# Altium schematic sheet Mother Board Connectors.SchDoc
size B
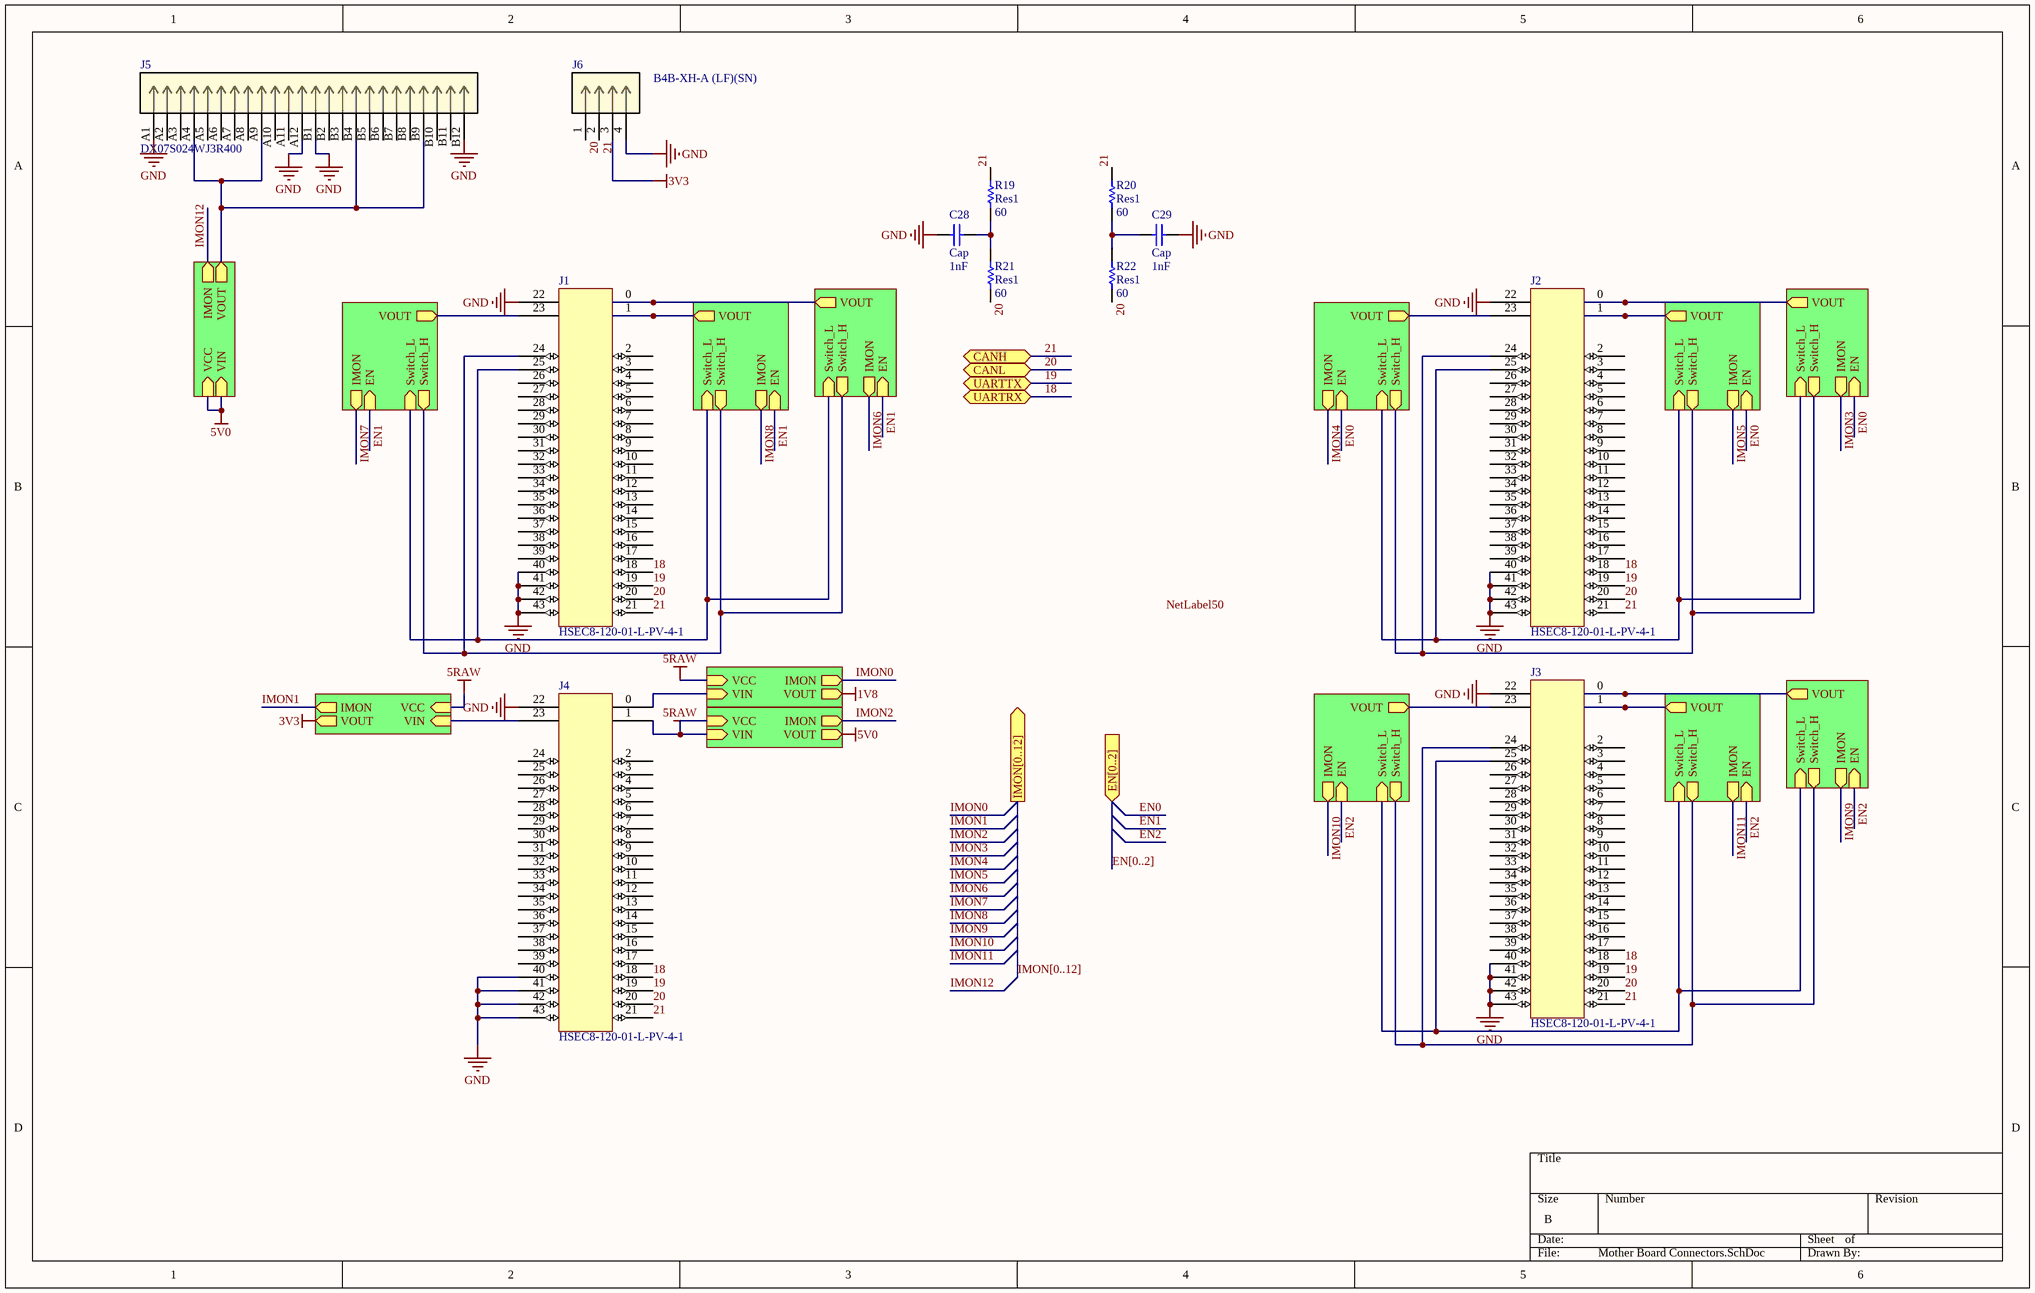
[diagram p0: Mother Board Connectors.SchDoc]

## Parts
C28  Cap  value 1nF  [1608[0603]]
C29  Cap  value 1nF  [1608[0603]]
J1  HSEC8-120-01-L-PV-4-1  [HSEC8-120-01-L-PV-4-1]
J2  HSEC8-120-01-L-PV-4-1  [HSEC8-120-01-L-PV-4-1]
J3  HSEC8-120-01-L-PV-4-1  [HSEC8-120-01-L-PV-4-1]
J4  HSEC8-120-01-L-PV-4-1  [HSEC8-120-01-L-PV-4-1]
J5  DX07S024WJ3R400  [CONN_DX07S024WJ1R350_JAE]
J6  B4B-XH-A (LF)(SN)  [CONN_B4B-XH-A (LF)(SN)_JST]
R19  Res1  value 60  [0402-A]
R20  Res1  value 60  [0402-A]
R21  Res1  value 60  [0402-A]
R22  Res1  value 60  [0402-A]

## Sub-sheets
Designator = Current-LoadSwitches 1V8.SchDoc: EN (in), Switch_L (in), IMON (out), VOUT (out), Switch_H (out)
Designator = Current-LoadSwitches 5V0.SchDoc: EN (in), Switch_L (in), IMON (out), VOUT (out), Switch_H (out)
Designator = Current-LoadSwitches 3V3.SchDoc: EN (in), Switch_L (in), IMON (out), VOUT (out), Switch_H (out)
Designator = Current-LoadSwitches 1V8.SchDoc: EN (in), Switch_L (in), IMON (out), VOUT (out), Switch_H (out)
Designator = Current-LoadSwitches 5V0.SchDoc: EN (in), Switch_L (in), IMON (out), VOUT (out), Switch_H (out)
Designator = Current-LoadSwitches 3V3.SchDoc: EN (in), Switch_L (in), IMON (out), VOUT (out), Switch_H (out)
Designator = Current-LoadSwitches 1V8.SchDoc: EN (in), Switch_L (in), IMON (out), VOUT (out), Switch_H (out)
Designator = Current-LoadSwitches 5V0.SchDoc: EN (in), Switch_L (in), IMON (out), VOUT (out), Switch_H (out)
Designator = Current-LoadSwitches 3V3.SchDoc: EN (in), Switch_L (in), IMON (out), VOUT (out), Switch_H (out)
Designator = Current-LoadSwitches PMS.SchDoc: VIN (in), IMON (out), VOUT (out), VCC (in)
Designator = Current-LoadSwitches PMS.SchDoc: VIN (in), IMON (out), VOUT (out), VCC (in)
Designator = Current-LoadSwitches PMS.SchDoc: VIN (in), IMON (out), VOUT (out), VCC (in)
Designator = Current-LoadSwitches PMS.SchDoc: VIN (in), IMON (out), VOUT (out), VCC (in)

## Ports
CANH (bidir), CANL (bidir), EN[0..2] (in), IMON[0..12] (out), UARTRX (bidir), UARTTX (bidir)

## Nets
1V8: sheet Designator/VOUT
3V3: J6.3 ; sheet Designator/VOUT
5RAW: J4.1 ; sheet Designator/VCC, sheet Designator/VIN, sheet Designator/VCC, sheet Designator/VCC
5V0: sheet Designator/VOUT, sheet Designator/VIN, sheet Designator/VCC
GND: C28.2 C29.1 J1.22 J1.40 J1.41 J1.42 J1.43 J2.22 J2.40 J2.41 J2.42 J2.43 J3.22 J3.40 J3.41 J3.42 J3.43 J4.22 J4.40 J4.41 J4.42 J4.43 J5.A1 J5.A12(B7) J5.B1(A7) J5.B12(B1) J6.4
18: J1.18 J2.18 J3.18 J4.18 ; port UARTRX
19: J1.19 J2.19 J3.19 J4.19 ; port UARTTX
20: J1.20 J2.20 J3.20 J4.20 J6.1 R21.1 R22.1 ; port CANL
21: J1.21 J2.21 J3.21 J4.21 J6.2 R19.2 R20.2 ; port CANH
EN0: sheet Designator/EN, sheet Designator/EN, sheet Designator/EN
EN1: sheet Designator/EN, sheet Designator/EN, sheet Designator/EN
EN2: sheet Designator/EN, sheet Designator/EN, sheet Designator/EN
IMON0: sheet Designator/IMON
IMON1: sheet Designator/IMON
IMON2: sheet Designator/IMON
IMON3: sheet Designator/IMON
IMON4: sheet Designator/IMON
IMON5: sheet Designator/IMON
IMON6: sheet Designator/IMON
IMON7: sheet Designator/IMON
IMON8: sheet Designator/IMON
IMON9: sheet Designator/IMON
IMON10: sheet Designator/IMON
IMON11: sheet Designator/IMON
IMON12: sheet Designator/IMON
NetC28_1: C28.1 R19.1 R21.2
NetC29_2: C29.2 R20.1 R22.2
NetJ1_0: J1.0 ; sheet Designator/VOUT
NetJ1_1: J1.1 ; sheet Designator/VOUT
NetJ1_23: J1.23 ; sheet Designator/VOUT
NetJ1_24: J1.24 ; sheet Designator/Switch_H, sheet Designator/Switch_H, sheet Designator/Switch_H
NetJ1_25: J1.25 ; sheet Designator/Switch_L, sheet Designator/Switch_L, sheet Designator/Switch_L
NetJ2_0: J2.0 ; sheet Designator/VOUT
NetJ2_1: J2.1 ; sheet Designator/VOUT
NetJ2_23: J2.23 ; sheet Designator/VOUT
NetJ2_24: J2.24 ; sheet Designator/Switch_H, sheet Designator/Switch_H, sheet Designator/Switch_H
NetJ2_25: J2.25 ; sheet Designator/Switch_L, sheet Designator/Switch_L, sheet Designator/Switch_L
NetJ3_0: J3.0 ; sheet Designator/VOUT
NetJ3_1: J3.1 ; sheet Designator/VOUT
NetJ3_23: J3.23 ; sheet Designator/VOUT
NetJ3_24: J3.24 ; sheet Designator/Switch_H, sheet Designator/Switch_H, sheet Designator/Switch_H
NetJ3_25: J3.25 ; sheet Designator/Switch_L, sheet Designator/Switch_L, sheet Designator/Switch_L
NetJ4_0: J4.0 ; sheet Designator/VIN
NetJ4_23: J4.23 ; sheet Designator/VIN
NetJ5_A4: J5.A4(B11) J5.A9(A5) J5.B4(B5) J5.B9(A11) ; sheet Designator/VOUT

Not connected (* = marked no-connect by the designer): J1 2(0) 3(0) 4(0) 5(0) 6(0) 7(0) 8(0) 9(0) 10(0) 11(0) 12(0) 13(0) 14(0) 15(0) 16(0) 17(0) 26 27 28 29 30 31 32 33 34 35 36 37 38 39; J2 2(0) 3(0) 4(0) 5(0) 6(0) 7(0) 8(0) 9(0) 10(0) 11(0) 12(0) 13(0) 14(0) 15(0) 16(0) 17(0) 26 27 28 29 30 31 32 33 34 35 36 37 38 39; J3 2(0) 3(0) 4(0) 5(0) 6(0) 7(0) 8(0) 9(0) 10(0) 11(0) 12(0) 13(0) 14(0) 15(0) 16(0) 17(0) 26 27 28 29 30 31 32 33 34 35 36 37 38 39; J4 2(0) 3(0) 4(0) 5(0) 6(0) 7(0) 8(0) 9(0) 10(0) 11(0) 12(0) 13(0) 14(0) 15(0) 16(0) 17(0) 24 25 26 27 28 29 30 31 32 33 34 35 36 37 38 39; J5 A2(B12) A3(A2) A5(A3) A6(B10) A7(A4) A8(B9) A10(B8) A11(A6) B2(B6) B3(A8) B5(A9) B6(B4) B7(A10) B8(B3) B10(B2) B11(A12)

## Buses and harness runs
bus EN[0..2] = port EN[0..2]
bus IMON[0..12] = port IMON[0..12]

## Notes on the sheet
- Labels drawn without touching a wire or pin: NetLabel50

## Library data of the parts
C28 C29 = Cap: Capacitor; Published: 8-Jun-2000; LatestRevisionDate: 17-Jul-2002; LatestRevisionNote: Re-released for DXP Platform.; PackageReference: RAD-0.3; Publisher: Altium Limited; PackageDescription: Radial Cap, Thru-Hole; 2 Leads; 0.3 in Pin Spacing
J5 = DX07S024WJ3R400: No Description Available; Vendor: JAE Electronics; Built_By: EMA_TJ; SourceLibrary: JAE_2019-01-31; Copyright: Copyright (C) 2018 Accelerated Designs. All rights reserved; Manufacturer_Part_Number: DX07S024WJ3R400; RefDes: RefDes; Type: DEV
J6 = B4B-XH-A (LF)(SN): No Description Available; Vendor: JST; Built_By: EMA_Cory; SourceLibrary: JST_2020-02-03; Datasheet: http://www.jst-mfg.com/product/pdf/eng/eXH.pdf; Manufacturer_Part_Number: B4B-XH-A (LF)(SN); Copyright: Copyright (C) 2018 Accelerated Designs. All rights reserved; RefDes: RefDes; Type: DEV
R19-R22 = Res1: Resistor; Published: 8-Jun-2000; LatestRevisionDate: 17-Jul-2002; LatestRevisionNote: Re-released for DXP Platform.; PackageReference: AXIAL-0.3; Publisher: Altium Limited; PackageDescription: Axial Device, Thru-Hole; 2 Leads; 0.3 in Pin Spacing
J1-J4 = HSEC8-120-01-L-PV-4-1: Supplier 1: Mouser